# Altium schematic sheet Motor_Drivers.SchDoc
size B; SheetNumber: 3; SheetTotal: 5
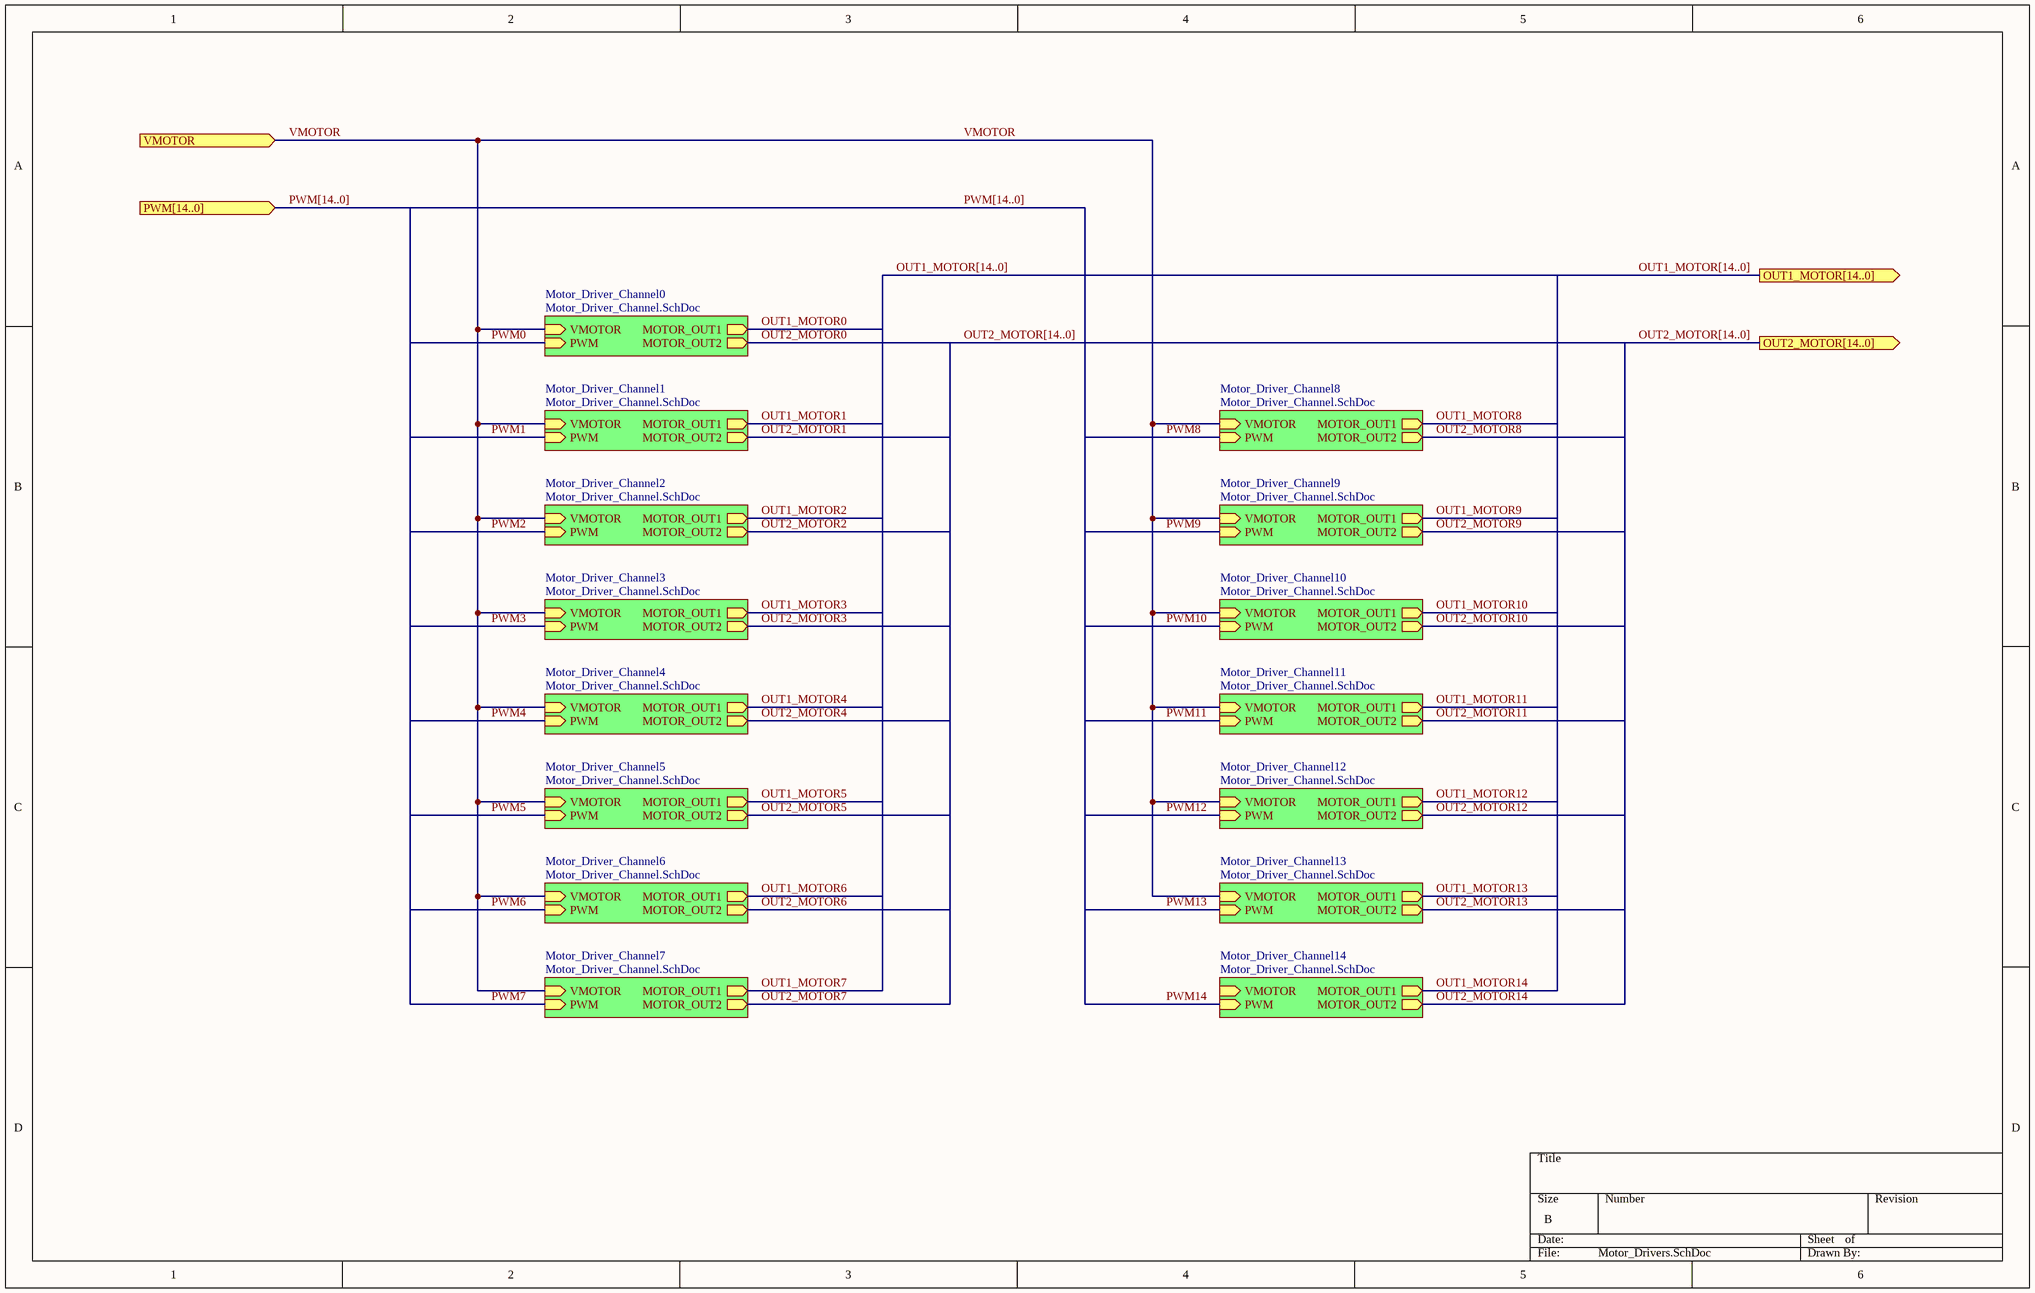
[diagram p0: Motor_Drivers.SchDoc]

## Sub-sheets
Motor_Driver_Channel0 = Motor_Driver_Channel.SchDoc: VMOTOR (in), PWM (in), MOTOR_OUT1 (out), MOTOR_OUT2 (out)
Motor_Driver_Channel1 = Motor_Driver_Channel.SchDoc: VMOTOR (in), PWM (in), MOTOR_OUT1 (out), MOTOR_OUT2 (out)
Motor_Driver_Channel2 = Motor_Driver_Channel.SchDoc: VMOTOR (in), PWM (in), MOTOR_OUT1 (out), MOTOR_OUT2 (out)
Motor_Driver_Channel3 = Motor_Driver_Channel.SchDoc: VMOTOR (in), PWM (in), MOTOR_OUT1 (out), MOTOR_OUT2 (out)
Motor_Driver_Channel4 = Motor_Driver_Channel.SchDoc: VMOTOR (in), PWM (in), MOTOR_OUT1 (out), MOTOR_OUT2 (out)
Motor_Driver_Channel5 = Motor_Driver_Channel.SchDoc: VMOTOR (in), PWM (in), MOTOR_OUT1 (out), MOTOR_OUT2 (out)
Motor_Driver_Channel6 = Motor_Driver_Channel.SchDoc: VMOTOR (in), PWM (in), MOTOR_OUT1 (out), MOTOR_OUT2 (out)
Motor_Driver_Channel7 = Motor_Driver_Channel.SchDoc: VMOTOR (in), PWM (in), MOTOR_OUT1 (out), MOTOR_OUT2 (out)
Motor_Driver_Channel8 = Motor_Driver_Channel.SchDoc: VMOTOR (in), PWM (in), MOTOR_OUT1 (out), MOTOR_OUT2 (out)
Motor_Driver_Channel9 = Motor_Driver_Channel.SchDoc: VMOTOR (in), PWM (in), MOTOR_OUT1 (out), MOTOR_OUT2 (out)
Motor_Driver_Channel10 = Motor_Driver_Channel.SchDoc: VMOTOR (in), PWM (in), MOTOR_OUT1 (out), MOTOR_OUT2 (out)
Motor_Driver_Channel11 = Motor_Driver_Channel.SchDoc: VMOTOR (in), PWM (in), MOTOR_OUT1 (out), MOTOR_OUT2 (out)
Motor_Driver_Channel12 = Motor_Driver_Channel.SchDoc: VMOTOR (in), PWM (in), MOTOR_OUT1 (out), MOTOR_OUT2 (out)
Motor_Driver_Channel13 = Motor_Driver_Channel.SchDoc: VMOTOR (in), PWM (in), MOTOR_OUT1 (out), MOTOR_OUT2 (out)
Motor_Driver_Channel14 = Motor_Driver_Channel.SchDoc: VMOTOR (in), PWM (in), MOTOR_OUT1 (out), MOTOR_OUT2 (out)

## Ports
OUT1_MOTOR[14..0] (out), OUT2_MOTOR[14..0] (out), PWM[14..0] (in), VMOTOR (in)

## Nets
OUT1_MOTOR0: sheet Motor_Driver_Channel0/MOTOR_OUT1
OUT1_MOTOR1: sheet Motor_Driver_Channel1/MOTOR_OUT1
OUT1_MOTOR2: sheet Motor_Driver_Channel2/MOTOR_OUT1
OUT1_MOTOR3: sheet Motor_Driver_Channel3/MOTOR_OUT1
OUT1_MOTOR4: sheet Motor_Driver_Channel4/MOTOR_OUT1
OUT1_MOTOR5: sheet Motor_Driver_Channel5/MOTOR_OUT1
OUT1_MOTOR6: sheet Motor_Driver_Channel6/MOTOR_OUT1
OUT1_MOTOR7: sheet Motor_Driver_Channel7/MOTOR_OUT1
OUT1_MOTOR8: sheet Motor_Driver_Channel8/MOTOR_OUT1
OUT1_MOTOR9: sheet Motor_Driver_Channel9/MOTOR_OUT1
OUT1_MOTOR10: sheet Motor_Driver_Channel10/MOTOR_OUT1
OUT1_MOTOR11: sheet Motor_Driver_Channel11/MOTOR_OUT1
OUT1_MOTOR12: sheet Motor_Driver_Channel12/MOTOR_OUT1
OUT1_MOTOR13: sheet Motor_Driver_Channel13/MOTOR_OUT1
OUT1_MOTOR14: sheet Motor_Driver_Channel14/MOTOR_OUT1
OUT2_MOTOR0: sheet Motor_Driver_Channel0/MOTOR_OUT2
OUT2_MOTOR1: sheet Motor_Driver_Channel1/MOTOR_OUT2
OUT2_MOTOR2: sheet Motor_Driver_Channel2/MOTOR_OUT2
OUT2_MOTOR3: sheet Motor_Driver_Channel3/MOTOR_OUT2
OUT2_MOTOR4: sheet Motor_Driver_Channel4/MOTOR_OUT2
OUT2_MOTOR5: sheet Motor_Driver_Channel5/MOTOR_OUT2
OUT2_MOTOR6: sheet Motor_Driver_Channel6/MOTOR_OUT2
OUT2_MOTOR7: sheet Motor_Driver_Channel7/MOTOR_OUT2
OUT2_MOTOR8: sheet Motor_Driver_Channel8/MOTOR_OUT2
OUT2_MOTOR9: sheet Motor_Driver_Channel9/MOTOR_OUT2
OUT2_MOTOR10: sheet Motor_Driver_Channel10/MOTOR_OUT2
OUT2_MOTOR11: sheet Motor_Driver_Channel11/MOTOR_OUT2
OUT2_MOTOR12: sheet Motor_Driver_Channel12/MOTOR_OUT2
OUT2_MOTOR13: sheet Motor_Driver_Channel13/MOTOR_OUT2
OUT2_MOTOR14: sheet Motor_Driver_Channel14/MOTOR_OUT2
PWM0: sheet Motor_Driver_Channel0/PWM
PWM1: sheet Motor_Driver_Channel1/PWM
PWM2: sheet Motor_Driver_Channel2/PWM
PWM3: sheet Motor_Driver_Channel3/PWM
PWM4: sheet Motor_Driver_Channel4/PWM
PWM5: sheet Motor_Driver_Channel5/PWM
PWM6: sheet Motor_Driver_Channel6/PWM
PWM7: sheet Motor_Driver_Channel7/PWM
PWM8: sheet Motor_Driver_Channel8/PWM
PWM9: sheet Motor_Driver_Channel9/PWM
PWM10: sheet Motor_Driver_Channel10/PWM
PWM11: sheet Motor_Driver_Channel11/PWM
PWM12: sheet Motor_Driver_Channel12/PWM
PWM13: sheet Motor_Driver_Channel13/PWM
PWM14: sheet Motor_Driver_Channel14/PWM
VMOTOR: port VMOTOR, sheet Motor_Driver_Channel0/VMOTOR, sheet Motor_Driver_Channel1/VMOTOR, sheet Motor_Driver_Channel2/VMOTOR, sheet Motor_Driver_Channel3/VMOTOR, sheet Motor_Driver_Channel4/VMOTOR, sheet Motor_Driver_Channel5/VMOTOR, sheet Motor_Driver_Channel6/VMOTOR, sheet Motor_Driver_Channel7/VMOTOR, sheet Motor_Driver_Channel8/VMOTOR, sheet Motor_Driver_Channel9/VMOTOR, sheet Motor_Driver_Channel10/VMOTOR, sheet Motor_Driver_Channel11/VMOTOR, sheet Motor_Driver_Channel12/VMOTOR, sheet Motor_Driver_Channel13/VMOTOR

## Buses and harness runs
bus OUT1_MOTOR[14..0] = port OUT1_MOTOR[14..0]
bus OUT2_MOTOR[14..0] = port OUT2_MOTOR[14..0]
bus PWM[14..0] = port PWM[14..0]